# Altium project QUTMS 2021 Shutdown Redesign.PrjPcb
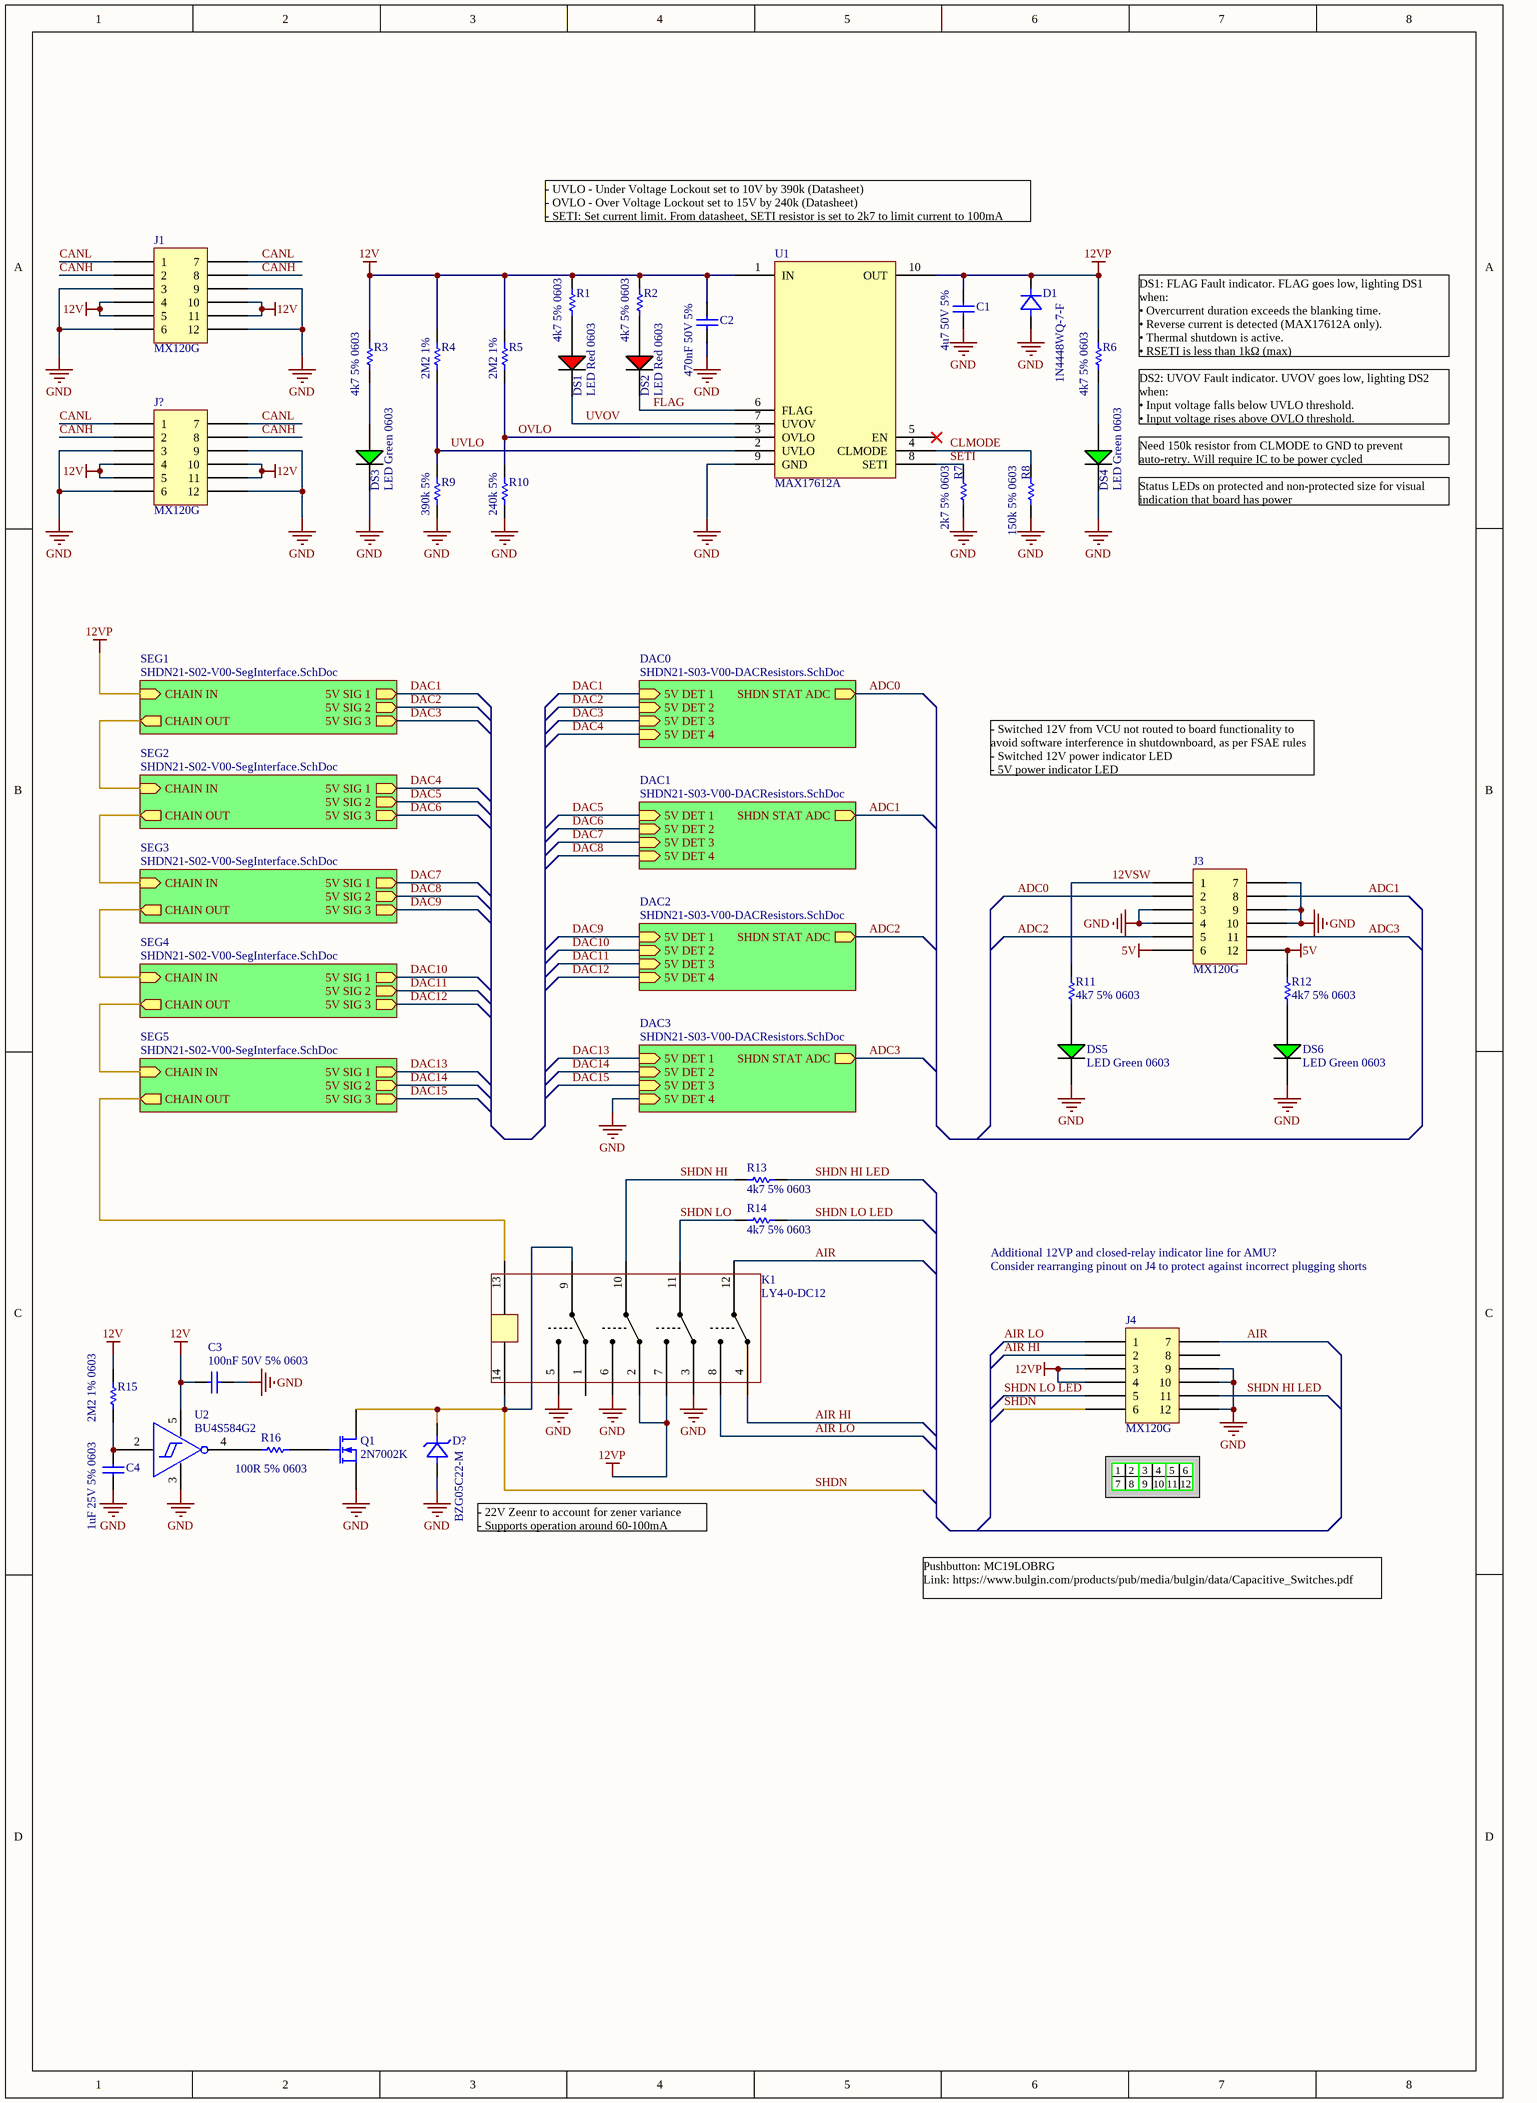
[diagram p0: SHDN21-S01-V00-Shutdown.SchDoc]
2 sheets, 71 parts. Net scope: hierarchical (ports join the sheet entries above them; power ports are global).
Sheets:
  SHDN21-S01-V00-Shutdown.SchDoc
    SEG1 = SHDN21-S02-V00-SegInterface.SchDoc
    SEG2 = SHDN21-S02-V00-SegInterface.SchDoc
    SEG3 = SHDN21-S02-V00-SegInterface.SchDoc
    SEG4 = SHDN21-S02-V00-SegInterface.SchDoc
    SEG5 = SHDN21-S02-V00-SegInterface.SchDoc

## Sheet SHDN21-S01-V00-Shutdown.SchDoc
size A3 portrait

### Parts
C1  4u7 50V 5%  [Cap_Ceramic_0603]
C2  470nF 50V 5%  [Cap_Ceramic_0603]
C3  100nF 50V 5% 0603  [Cap_Ceramic_0603]
C4  1uF 25V 5% 0603  [Cap_Ceramic_0603]
D1  1N4448WQ-7-F  [SMA]
D?  BZG05C22-M
DS1  LED Red 0603  [LED RED 0603]
DS2  LED Red 0603  [LED RED 0603]
DS3  LED Green 0603  [LED GREEN 0603]
DS4  LED Green 0603  [LED GREEN 0603]
DS5  LED Green 0603  [LED GREEN 0603]
DS6  LED Green 0603  [LED GREEN 0603]
J1  MX120G
J3  MX120G
J4  MX120G
J?  MX120G
K1  LY4-0-DC12
Q1  2N7002K  [SOT-23-3]
R1  4k7 5% 0603  [Res_ThinFilm_0603]
R2  4k7 5% 0603  [Res_ThinFilm_0603]
R3  4k7 5% 0603  [Res_ThinFilm_0603]
R4  2M2 1%  [Res_ThinFilm_0603]
R5  2M2 1%  [Res_ThinFilm_0603]
R6  4k7 5% 0603  [Res_ThinFilm_0603]
R7  2k7 5% 0603  [Res_ThinFilm_0603]
R8  150k 5% 0603  [Res_ThinFilm_0603]
R9  390k 5%  [Res_ThinFilm_0603]
R10  240k 5%  [Res_ThinFilm_0603]
R11  4k7 5% 0603  [Res_ThinFilm_0603]
R12  4k7 5% 0603  [Res_ThinFilm_0603]
R13  4k7 5% 0603  [Res_ThinFilm_0603]
R14  4k7 5% 0603  [Res_ThinFilm_0603]
R15  2M2 1% 0603  [Res_ThinFilm_0603]
R16  100R 5% 0603  [Res_ThinFilm_0603]
U1  MAX17612A
U2  BU4S584G2

### Sub-sheets
DAC0 = SHDN21-S03-V00-DACResistors.SchDoc (file not in this document): 5V DET 1 (in), SHDN STAT ADC (out), 5V DET 2 (in), 5V DET 3 (in), 5V DET 4 (in)
DAC1 = SHDN21-S03-V00-DACResistors.SchDoc (file not in this document): 5V DET 1 (in), SHDN STAT ADC (out), 5V DET 2 (in), 5V DET 3 (in), 5V DET 4 (in)
DAC2 = SHDN21-S03-V00-DACResistors.SchDoc (file not in this document): 5V DET 1 (in), SHDN STAT ADC (out), 5V DET 2 (in), 5V DET 3 (in), 5V DET 4 (in)
DAC3 = SHDN21-S03-V00-DACResistors.SchDoc (file not in this document): 5V DET 1 (in), SHDN STAT ADC (out), 5V DET 2 (in), 5V DET 3 (in), 5V DET 4 (in)
SEG1 = SHDN21-S02-V00-SegInterface.SchDoc: CHAIN IN (in), 5V SIG 1 (out), 5V SIG 2 (out), 5V SIG 3 (out), CHAIN OUT (out)
SEG2 = SHDN21-S02-V00-SegInterface.SchDoc: CHAIN IN (in), 5V SIG 1 (out), 5V SIG 2 (out), 5V SIG 3 (out), CHAIN OUT (out)
SEG3 = SHDN21-S02-V00-SegInterface.SchDoc: CHAIN IN (in), 5V SIG 1 (out), 5V SIG 2 (out), 5V SIG 3 (out), CHAIN OUT (out)
SEG4 = SHDN21-S02-V00-SegInterface.SchDoc: CHAIN IN (in), 5V SIG 1 (out), 5V SIG 2 (out), 5V SIG 3 (out), CHAIN OUT (out)
SEG5 = SHDN21-S02-V00-SegInterface.SchDoc: CHAIN IN (in), 5V SIG 1 (out), 5V SIG 2 (out), 5V SIG 3 (out), CHAIN OUT (out)

### Nets
5V: J3.6 J3.12 R12.2
12V: C2.2 C3.1 J1.4 J1.5 J1.10 J1.11 J?.4 J?.5 J?.10 J?.11 R1.2 R2.2 R3.2 R4.2 R5.2 R15.2 U1.1(IN) U2.5(VDD)
12VP: C1.2 D1.K(Cathode) J4.3 J4.4 K1.2 K1.7 R6.2 U1.10(OUT) ; sheet SEG1/CHAIN IN
GND: C1.1 C2.1 C3.2 C4.1 D1.A(Anode) D?.A(Anode) DS3.2(C) DS4.2(C) DS5.2(C) DS6.2(C) J1.3 J1.6 J1.9 J1.12 J3.3 J3.4 J3.7 J3.9 J3.10 J4.9 J4.10 J4.12 J?.3 J?.6 J?.9 J?.12 K1.3 K1.5 K1.6 Q1.S R7.2 R8.1 R9.1 R10.1 U1.9(GND) U2.3(VSS) ; sheet DAC3/5V DET 4
12VSW: J3.1 R11.2
ADC0: J3.2 ; sheet DAC0/SHDN STAT ADC
ADC1: J3.8 ; sheet DAC1/SHDN STAT ADC
ADC2: J3.5 ; sheet DAC2/SHDN STAT ADC
ADC3: J3.11 ; sheet DAC3/SHDN STAT ADC
AIR: J4.7 K1.12
AIR HI: J4.2 K1.4
AIR LO: J4.1 K1.8
CANH: J1.2 J1.8 J?.2 J?.8
CANL: J1.1 J1.7 J?.1 J?.7
CLMODE: R8.2 U1.4(CLMODE)
DAC1: sheet SEG1/5V SIG 1, sheet DAC0/5V DET 1
DAC2: sheet SEG1/5V SIG 2, sheet DAC0/5V DET 2
DAC3: sheet SEG1/5V SIG 3, sheet DAC0/5V DET 3
DAC4: sheet SEG2/5V SIG 1, sheet DAC0/5V DET 4
DAC5: sheet SEG2/5V SIG 2, sheet DAC1/5V DET 1
DAC6: sheet SEG2/5V SIG 3, sheet DAC1/5V DET 2
DAC7: sheet SEG3/5V SIG 1, sheet DAC1/5V DET 3
DAC8: sheet SEG3/5V SIG 2, sheet DAC1/5V DET 4
DAC9: sheet SEG3/5V SIG 3, sheet DAC2/5V DET 1
DAC10: sheet SEG4/5V SIG 1, sheet DAC2/5V DET 2
DAC11: sheet SEG4/5V SIG 2, sheet DAC2/5V DET 3
DAC12: sheet SEG4/5V SIG 3, sheet DAC2/5V DET 4
DAC13: sheet SEG5/5V SIG 1, sheet DAC3/5V DET 1
DAC14: sheet SEG5/5V SIG 2, sheet DAC3/5V DET 2
DAC15: sheet SEG5/5V SIG 3, sheet DAC3/5V DET 3
FLAG: DS2.2(C) U1.6(FLAG)
OVLO: R5.1 R10.2 U1.3(OVLO)
SETI: R7.1 U1.8(SETI)
SHDN: D?.K(Cathode) J4.6 K1.9 K1.14 Q1.D
SHDN HI: K1.10 R13.1
SHDN HI LED: J4.11 R13.2
SHDN LO: K1.11 R14.1
SHDN LO LED: J4.5 R14.2
UVLO: R4.1 R9.2 U1.2(UVLO)
UVOV: DS1.2(C) U1.7(UVOV)
NetC4_2: C4.2 R15.1 U2.2(A)
NetDS1_1: DS1.1(A) R1.1
NetDS2_1: DS2.1(A) R2.1
NetDS3_1: DS3.1(A) R3.1
NetDS4_1: DS4.1(A) R6.1
NetDS5_1: DS5.1(A) R11.1
NetDS6_1: DS6.1(A) R12.1
NetJ5_SEG1_12: sheet SEG1/CHAIN OUT, sheet SEG2/CHAIN IN
NetJ5_SEG2_12: sheet SEG2/CHAIN OUT, sheet SEG3/CHAIN IN
NetJ5_SEG3_12: sheet SEG3/CHAIN OUT, sheet SEG4/CHAIN IN
NetJ5_SEG4_12: sheet SEG4/CHAIN OUT, sheet SEG5/CHAIN IN
NetJ5_SEG5_12: K1.13 ; sheet SEG5/CHAIN OUT
NetQ1_G: Q1.G R16.2
NetR16_1: R16.1 U2.4(Y)

Not connected (* = marked no-connect by the designer): J4 8; K1 1; U1 5(EN)*

### Notes on the sheet
- - UVLO - Under Voltage Lockout set to 10V by 390k (Datasheet)
  - OVLO - Over Voltage Lockout set to 15V by 240k (Datasheet)
  - SETI: Set current limit. From datasheet, SETI resistor is set to 2k7 to limit current to 100mA
- (near R6) DS1: FLAG Fault indicator. FLAG goes low, lighting DS1 when:
  • Overcurrent duration exceeds the blanking time.
  • Reverse current is detected (MAX17612A only).
  • Thermal shutdown is active.
  • RSETI is less than 1kΩ (max)
- DS2: UVOV Fault indicator. UVOV goes low, lighting DS2 when:
  • Input voltage falls below UVLO threshold.
  • Input voltage rises above OVLO threshold.
- (near DS4) Need 150k resistor from CLMODE to GND to prevent auto-retry. Will require IC to be power cycled
- (near DS4) Status LEDs on protected and non-protected size for visual indication that board has power
- - Switched 12V from VCU not routed to board functionality to avoid software interference in shutdownboard, as per FSAE rules
  - Switched 12V power indicator LED
  - 5V power indicator LED
- Additional 12VP and closed-relay indicator line for AMU?
- Consider rearranging pinout on J4 to protect against incorrect plugging shorts
- 1
- 7
- 2
- 8
- 3
- 9
- 4
- 10
- 5
- 11
- 6
- 12
- - 22V Zeenr to account for zener variance
  - Supports operation around 60-100mA
- Pushbutton: MC19LOBRG
  Link: https://www.bulgin.com/products/pub/media/bulgin/data/Capacitive_Switches.pdf

### Library data of the parts
C1 = 4u7 50V 5% X7R 0603: Capacitor, Ceramic, SMD, 4u7, 50V, 5%, X7R, 0603
C2 = 470nF 50V 5% X7R 0603: Capacitor, Ceramic, SMD, 470nF, 50V, 5%, X7R, 0603
C3 = 100nF 50V 5% X7R 0603: Capacitor, Ceramic, SMD, 100nF, 50V, 5%, X7R, 0603
C4 = 1uF 25V 5% X7R 0603: Capacitor, Ceramic, SMD, 1uF, 25V, 5%, X7R, 0603
D1 = 1N4448WQ-7-F: Diode, SMD, 75V, 5%, 250mA, SOD123; Manufacturer: ON Semiconductor / Fairchild; Manufacturer Part Number: 1N914BWS; Average Rectified Current: 150mA; Element Configuration: Single; Forward Voltage: 1V; Max Reverse Leakage Current: 5uA; Power Dissipation: 200mW; Recovery Time: 4ns; Max Forward Surge Current (Ifsm): 4A; Parameter 1: *; Weight: 0.0276g; Category: Rectifier Diodes; Contact Plating: Tin,Matte; Forward Current: 150mA; Lead Free: Lead Free; Max Operating Temperature: 150°C; Max Repetitive Reverse Voltage (Vrrm): 75V; Max Reverse Voltage (DC): 75V; Min Operating Temperature: -55°C; Mount: Surface Mount; Number of Pins: 2; Package Quantity: 1; Packaging: Tape and Reel; Peak Reverse Current: 5uA; Radiation Hardening: No; REACH SVHC: No SVHC; Reverse Recovery Time: 4ns; Height: 1mm; Length: 1.8mm; Reverse Voltage: 75V; Width: 1.35mm
D? = BZG05C22-M: Zener Diodes Uni-direc 40W Pppm SMA (DO-214AC); ComponentLink1Description: Datasheet; ComponentLink1URL: https://au.mouser.com/datasheet/2/427/bzg05c-m-series-1767829.pdf
J1 J3 J4 J? = MX120G: MX120G with standard connector layout
K1 = LY4-0-DC12: RELAY GEN PURPOSE 4PDT 10A 12V Through-hole
Q1 = 2N7002K: N-Channel 60V 300mA (Ta) 350mW (Ta) Surface Mount SOT-23 (TO-236AB)
R1-R3 R6 R11-R14 = 4k7 5% 0603: Resistor, SMD, 4k7, 0.1W, 5%, 0603
R4 R5 R15 = 2M2 1% 0603: Resistor, SMD, 2M2, 0.125W, 1%, 0603
R7 = 2k7 5% 0603: Resistor, SMD, 2k7, 0.1W, 5%, 0603
R8 = 150k 5%, 0603: Resistor, SMD, 150k, 0.1W, 5%, 0603
R9 = 390k 5% 0603: Resistor, SMD, 390k, 0.1W, 5%, 0603
R10 = 240k 5% 0603: Resistor, SMD, 240k, 0.1W, 5%, 0603
R16 = 100R 5%, 0603: Resistor, SMD, 100R, 0.1W, 5%, 0603
U2 = BU4S584G2: IC INVERTER SCHMITT 1CH 5SSOP

## Sheet SHDN21-S02-V00-SegInterface.SchDoc
size A4
Used 5 times, as channels SEG1, SEG2, SEG3, SEG4, SEG5. Parts and nets are listed once, with the designators drawn on the sheet.
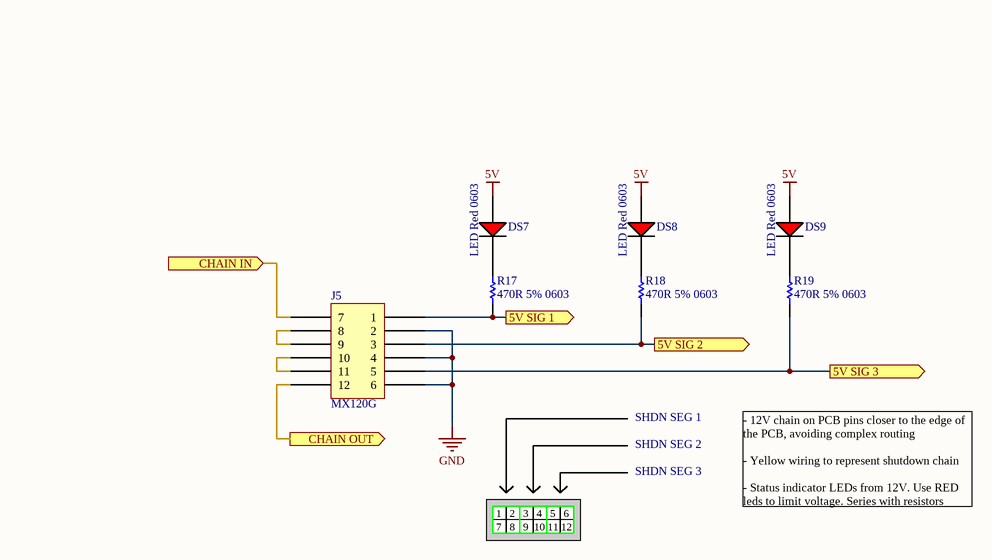
[diagram p1: SHDN21-S02-V00-SegInterface.SchDoc]

### Parts
DS7  LED Red 0603  [LED RED 0603]
DS8  LED Red 0603  [LED RED 0603]
DS9  LED Red 0603  [LED RED 0603]
J5  MX120G
R17  470R 5% 0603  [Res_ThinFilm_0603]
R18  470R 5% 0603  [Res_ThinFilm_0603]
R19  470R 5% 0603  [Res_ThinFilm_0603]

### Ports
5V SIG 1 (out), 5V SIG 2 (out), 5V SIG 3 (out), CHAIN IN (in), CHAIN OUT (out)

### Nets
5V: DS7.1(A) DS8.1(A) DS9.1(A)
GND: J5.2 J5.4 J5.6
5V SIG 1: J5.1 R17.1 ; port 5V SIG 1
5V SIG 2: J5.3 R18.1 ; port 5V SIG 2
5V SIG 3: J5.5 R19.1 ; port 5V SIG 3
CHAIN IN: J5.7 ; port CHAIN IN
CHAIN OUT: J5.12 ; port CHAIN OUT
NetDS7_2: DS7.2(C) R17.2
NetDS8_2: DS8.2(C) R18.2
NetDS9_2: DS9.2(C) R19.2
NetJ5_8: J5.8 J5.9
NetJ5_10: J5.10 J5.11

### Channels
SEG1: designators end in _SEG1; ports 5V SIG 1=DAC1 5V SIG 2=DAC2 5V SIG 3=DAC3 CHAIN IN=12VP CHAIN OUT=NetJ5_SEG1_12
SEG2: designators end in _SEG2; ports 5V SIG 1=DAC4 5V SIG 2=DAC5 5V SIG 3=DAC6 CHAIN IN=NetJ5_SEG1_12 CHAIN OUT=NetJ5_SEG2_12
SEG3: designators end in _SEG3; ports 5V SIG 1=DAC7 5V SIG 2=DAC8 5V SIG 3=DAC9 CHAIN IN=NetJ5_SEG2_12 CHAIN OUT=NetJ5_SEG3_12
SEG4: designators end in _SEG4; ports 5V SIG 1=DAC10 5V SIG 2=DAC11 5V SIG 3=DAC12 CHAIN IN=NetJ5_SEG3_12 CHAIN OUT=NetJ5_SEG4_12
SEG5: designators end in _SEG5; ports 5V SIG 1=DAC13 5V SIG 2=DAC14 5V SIG 3=DAC15 CHAIN IN=NetJ5_SEG4_12 CHAIN OUT=NetJ5_SEG5_12

### Notes on the sheet
- SHDN SEG 1
- SHDN SEG 2
- 1
- 7
- 2
- 8
- 3
- 9
- 4
- 10
- 5
- 11
- 6
- 12
- SHDN SEG 3
- - 12V chain on PCB pins closer to the edge of the PCB, avoiding complex routing
  - Yellow wiring to represent shutdown chain
  - Status indicator LEDs from 12V. Use RED leds to limit voltage. Series with resistors

### Library data of the parts
J5 = MX120G: MX120G with standard connector layout
R17-R19 = 470R 5% 0603: Resistor, SMD, 470R, 0.1W, 5%, 0603

## Nets that join several sheets
5V: SHDN21-S01-V00-Shutdown (J3.6 J3.12 R12.2), SEG1 (DS7_SEG1.1 DS8_SEG1.1 DS9_SEG1.1), SEG2 (DS7_SEG2.1 DS8_SEG2.1 DS9_SEG2.1), SEG3 (DS7_SEG3.1 DS8_SEG3.1 DS9_SEG3.1), SEG4 (DS7_SEG4.1 DS8_SEG4.1 DS9_SEG4.1), SEG5 (DS7_SEG5.1 DS8_SEG5.1 DS9_SEG5.1)
12VP: SHDN21-S01-V00-Shutdown (8 pins), SEG1 (J5_SEG1.7)
GND: SHDN21-S01-V00-Shutdown (36 pins), SEG1 (J5_SEG1.2 J5_SEG1.4 J5_SEG1.6), SEG2 (J5_SEG2.2 J5_SEG2.4 J5_SEG2.6), SEG3 (J5_SEG3.2 J5_SEG3.4 J5_SEG3.6), SEG4 (J5_SEG4.2 J5_SEG4.4 J5_SEG4.6), SEG5 (J5_SEG5.2 J5_SEG5.4 J5_SEG5.6)
NetJ5_SEG1_12: SEG1 (J5_SEG1.12), SEG2 (J5_SEG2.7)
NetJ5_SEG2_12: SEG2 (J5_SEG2.12), SEG3 (J5_SEG3.7)
NetJ5_SEG3_12: SEG3 (J5_SEG3.12), SEG4 (J5_SEG4.7)
NetJ5_SEG4_12: SEG4 (J5_SEG4.12), SEG5 (J5_SEG5.7)
NetJ5_SEG5_12: SHDN21-S01-V00-Shutdown (K1.13), SEG5 (J5_SEG5.12)